# EAGLE design smog_v1_1_ctrl (EAGLE 7.3.0)

## Sheet 1 of 2
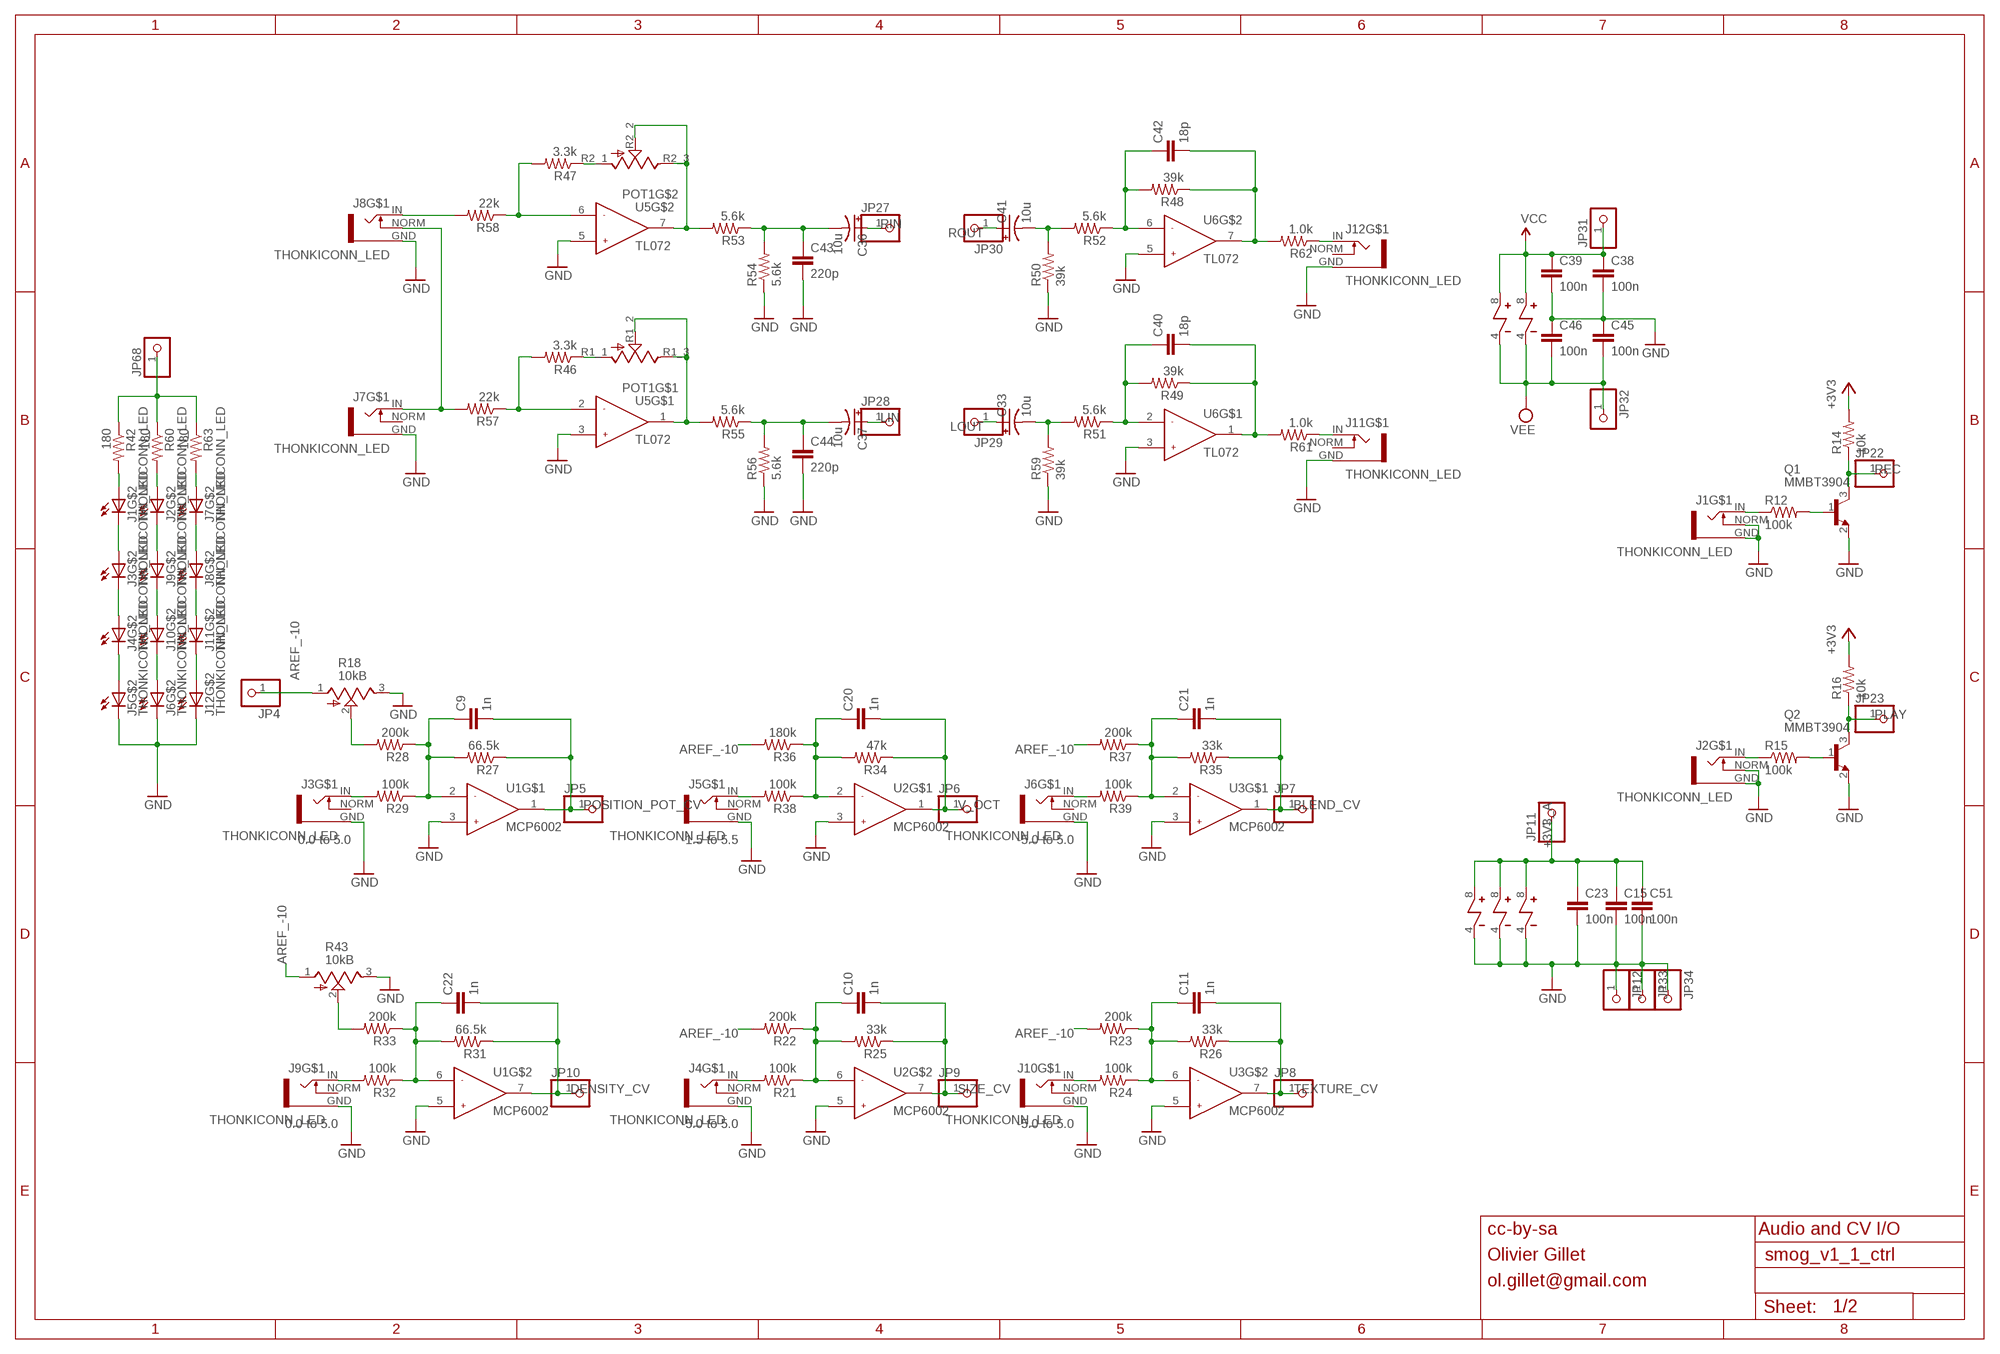
[diagram p0: schematic, sheet 1]

### Parts
C9  1n  CAPACITOR  [RESISTOR_0603]
C10  1n  CAPACITOR  [RESISTOR_0603]
C11  1n  CAPACITOR  [RESISTOR_0603]
C15  100n  CAPACITOR  [RESISTOR_0603]
C20  1n  CAPACITOR  [RESISTOR_0603]
C21  1n  CAPACITOR  [RESISTOR_0603]
C22  1n  CAPACITOR  [RESISTOR_0603]
C23  100n  CAPACITOR  [RESISTOR_0603]
C33  10u  CAP_POL  [PANASONIC_B]
C36  10u  CAP_POL  [PANASONIC_B]
C37  10u  CAP_POL  [PANASONIC_B]
C38  100n  CAPACITOR  [RESISTOR_0603]
C39  100n  CAPACITOR  [RESISTOR_0603]
C40  18p  CAPACITOR  [RESISTOR_0603]
C41  10u  CAP_POL  [PANASONIC_B]
C42  18p  CAPACITOR  [RESISTOR_0603]
C43  220p  CAPACITOR  [RESISTOR_0603]
C44  220p  CAPACITOR  [RESISTOR_0603]
C45  100n  CAPACITOR  [RESISTOR_0603]
C46  100n  CAPACITOR  [RESISTOR_0603]
C51  100n  CAPACITOR  [RESISTOR_0603]
J1  THONKICONN_LED  [LED_JACK]
J2  THONKICONN_LED  [LED_JACK]
J3  THONKICONN_LED  [LED_JACK]
J4  THONKICONN_LED  [LED_JACK]
J5  THONKICONN_LED  [LED_JACK]
J6  THONKICONN_LED  [LED_JACK]
J7  THONKICONN_LED  [LED_JACK]
J8  THONKICONN_LED  [LED_JACK]
J9  THONKICONN_LED  [LED_JACK]
J10  THONKICONN_LED  [LED_JACK]
J11  THONKICONN_LED  [LED_JACK]
J12  THONKICONN_LED  [LED_JACK]
JP4  PINHD-1X1  [1X01]
JP5  PINHD-1X1  [1X01]
JP6  PINHD-1X1  [1X01]
JP7  PINHD-1X1  [1X01]
JP8  PINHD-1X1  [1X01]
JP9  PINHD-1X1  [1X01]
JP10  PINHD-1X1  [1X01]
JP11  PINHD-1X1  [1X01]
JP12  PINHD-1X1  [1X01]
JP22  PINHD-1X1  [1X01]
JP23  PINHD-1X1  [1X01]
JP27  PINHD-1X1  [1X01]
JP28  PINHD-1X1  [1X01]
JP29  PINHD-1X1  [1X01]
JP30  PINHD-1X1  [1X01]
JP31  PINHD-1X1  [1X01]
JP32  PINHD-1X1  [1X01]
JP33  PINHD-1X1  [1X01]
JP34  PINHD-1X1  [1X01]
JP68  PINHD-1X1  [1X01]
POT1  POT_DUAL_THONK  [POT_DUAL_THONK]
Q1  MMBT3904  MMBT3904SOT23  [SOT23]
Q2  MMBT3904  MMBT3904SOT23  [SOT23]
R12  100k  RESISTOR  [RESISTOR_0603]
R14  10k  RESISTOR  [RESISTOR_0603]
R15  100k  RESISTOR  [RESISTOR_0603]
R16  10k  RESISTOR  [RESISTOR_0603]
R18  10kB  POT_VERTICAL  [ALPS_POT_VERTICAL]
R21  100k  RESISTOR  [RESISTOR_0603]
R22  200k  RESISTOR  [RESISTOR_0603]
R23  200k  RESISTOR  [RESISTOR_0603]
R24  100k  RESISTOR  [RESISTOR_0603]
R25  33k  RESISTOR  [RESISTOR_0603]
R26  33k  RESISTOR  [RESISTOR_0603]
R27  66.5k  RESISTOR  [RESISTOR_0603]
R28  200k  RESISTOR  [RESISTOR_0603]
R29  100k  RESISTOR  [RESISTOR_0603]
R31  66.5k  RESISTOR  [RESISTOR_0603]
R32  100k  RESISTOR  [RESISTOR_0603]
R33  200k  RESISTOR  [RESISTOR_0603]
R34  47k  RESISTOR  [RESISTOR_0603]
R35  33k  RESISTOR  [RESISTOR_0603]
R36  180k  RESISTOR  [RESISTOR_0603]
R37  200k  RESISTOR  [RESISTOR_0603]
R38  100k  RESISTOR  [RESISTOR_0603]
R39  100k  RESISTOR  [RESISTOR_0603]
R42  180  RESISTOR  [RESISTOR_0603]
R43  10kB  POT_VERTICAL  [ALPS_POT_VERTICAL]
R46  3.3k  RESISTOR  [RESISTOR_0603]
R47  3.3k  RESISTOR  [RESISTOR_0603]
R48  39k  RESISTOR  [RESISTOR_0603]
R49  39k  RESISTOR  [RESISTOR_0603]
R50  39k  RESISTOR  [RESISTOR_0603]
R51  5.6k  RESISTOR  [RESISTOR_0603]
R52  5.6k  RESISTOR  [RESISTOR_0603]
R53  5.6k  RESISTOR  [RESISTOR_0603]
R54  5.6k  RESISTOR  [RESISTOR_0603]
R55  5.6k  RESISTOR  [RESISTOR_0603]
R56  5.6k  RESISTOR  [RESISTOR_0603]
R57  22k  RESISTOR  [RESISTOR_0603]
R58  22k  RESISTOR  [RESISTOR_0603]
R59  39k  RESISTOR  [RESISTOR_0603]
R60  180  RESISTOR  [RESISTOR_0603]
R61  1.0k  RESISTOR  [RESISTOR_0603]
R62  1.0k  RESISTOR  [RESISTOR_0603]
R63  180  RESISTOR  [RESISTOR_0603]
U1  MCP6002  OPAMP_DUAL  [SOIC8]
U2  MCP6002  OPAMP_DUAL  [SOIC8]
U3  MCP6002  OPAMP_DUAL  [SOIC8]
U5  TL072  OPAMP_DUAL  [SOIC8]
U6  TL072  OPAMP_DUAL  [SOIC8]

### Nets
+3V3 [midwide]: R14.2 R16.2 ; also sheet 2
+3V3_A [midwide]: C15.1 C23.1 C51.1 JP11.1 U1.8 U2.8 U3.8 ; also sheet 2
AREF_-10: JP4.1 R18.1(A) R22.2 R23.2 R36.2 R37.2 R43.1(A)
BLEND_CV: C21.2 JP7.1 R35.1 U3.1
DENSITY_CV: C22.2 JP10.1 R31.1 U1.7
GND: C15.2 C23.2 C38.2 C39.2 C43.2 C44.2 C45.1 C46.1 C51.2 J1.GND J1.NORM J2.GND J2.NORM J3.GND J4.GND J5.C J5.GND J6.C J6.GND J7.GND J8.GND J9.GND J10.GND J11.GND J12.C J12.GND JP12.1 JP33.1 JP34.1 Q1.2(E) Q2.2(E) R18.3(B) R43.3(B) R50.1 R54.1 R56.1 R59.1 U1.3 U1.4 U1.5 U2.3 U2.4 U2.5 U3.3 U3.4 U3.5 U5.3 U5.5 U6.3 U6.5 ; also sheet 2
LIN: C37.+ JP28.1
LOUT: C33.+ JP29.1
LOUT_JACK: J11.IN R61.1
N$1: J4.IN R21.2
N$2: C10.1 R21.1 R22.1 R25.2 U2.6
N$3: J1.C J3.A
N$4: J10.IN R24.2
N$5: C11.1 R23.1 R24.1 R26.2 U3.6
N$6: J6.IN R39.2
N$7: J3.C J4.A
N$8: J4.C J5.A
N$10: J5.IN R38.2
N$11: C20.1 R34.2 R36.1 R38.1 U2.2
N$13: J2.A R60.2
N$14: J9.IN R32.2
N$15: C21.1 R35.2 R37.1 R39.1 U3.2
N$17: J2.C J9.A
N$18: C37.- C44.1 R55.1 R56.2
N$19: J9.C J10.A
N$20: J8.IN R58.2
N$21: J7.IN J8.NORM R57.2
N$22: C36.- C43.1 R53.1 R54.2
N$23: C41.- R50.2 R52.2
N$24: C22.1 R31.2 R32.1 R33.1 U1.6
N$25: C42.1 R48.2 R52.1 U6.6
N$26: R33.2 R43.2(W)
N$27: J3.IN R29.2
N$28: C42.2 R48.1 R62.2 U6.7
N$30: C9.1 R27.2 R28.1 R29.1 U1.2
N$31: C33.- R51.2 R59.2
N$32: C40.1 R49.2 R51.1 U6.2
N$33: C40.2 R49.1 R61.2 U6.1
N$35: R18.2(W) R28.2
N$36: J2.IN R15.1
N$37: Q2.1(B) R15.2
N$42: POT1.R2_2(W) POT1.R2_3(B) R53.2 U5.7
N$51: POT1.R1_2(W) POT1.R1_3(B) R55.2 U5.1
N$52: POT1.R2_1(A) R47.1
N$53: POT1.R1_1(A) R46.1
N$54: R47.2 R58.1 U5.6
N$55: J6.A J10.C
N$56: J7.A R63.2
N$57: J1.IN R12.1
N$58: R46.2 R57.1 U5.2
N$59: J7.C J8.A
N$60: J8.C J11.A
N$61: J11.C J12.A
N$62: J1.A R42.2
N$66: Q1.1(B) R12.2
N$75 [wide]: JP68.1 R42.1 R60.1 R63.1
PLAY: JP23.1 Q2.3(C) R16.1
POSITION_POT_CV: C9.2 JP5.1 R27.1 U1.1
REC: JP22.1 Q1.3(C) R14.1
RIN: C36.+ JP27.1
ROUT: C41.+ JP30.1
ROUT_JACK: J12.IN R62.1
SIZE_CV: C10.2 JP9.1 R25.1 U2.7
TEXTURE_CV: C11.2 JP8.1 R26.1 U3.7
V_OCT: C20.2 JP6.1 R34.1 U2.1
VCC [wide]: C38.1 C39.1 JP31.1 U5.8 U6.8
VEE [wide]: C45.2 C46.2 JP32.1 U5.4 U6.4
Unconnected: J3.NORM J4.NORM J5.NORM J6.NORM J7.NORM J9.NORM J10.NORM J11.NORM J12.NORM

### Notes on the sheet
- 0.0 to 5.0 | -1.5 to 5.5 | -5.0 to 5.0
- 0.0 to 5.0 | -5.0 to 5.0 | -5.0 to 5.0
- cc-by-sa | Audio and CV I/O
- Olivier Gillet
- ol.gillet@gmail.com

## Sheet 2 of 2
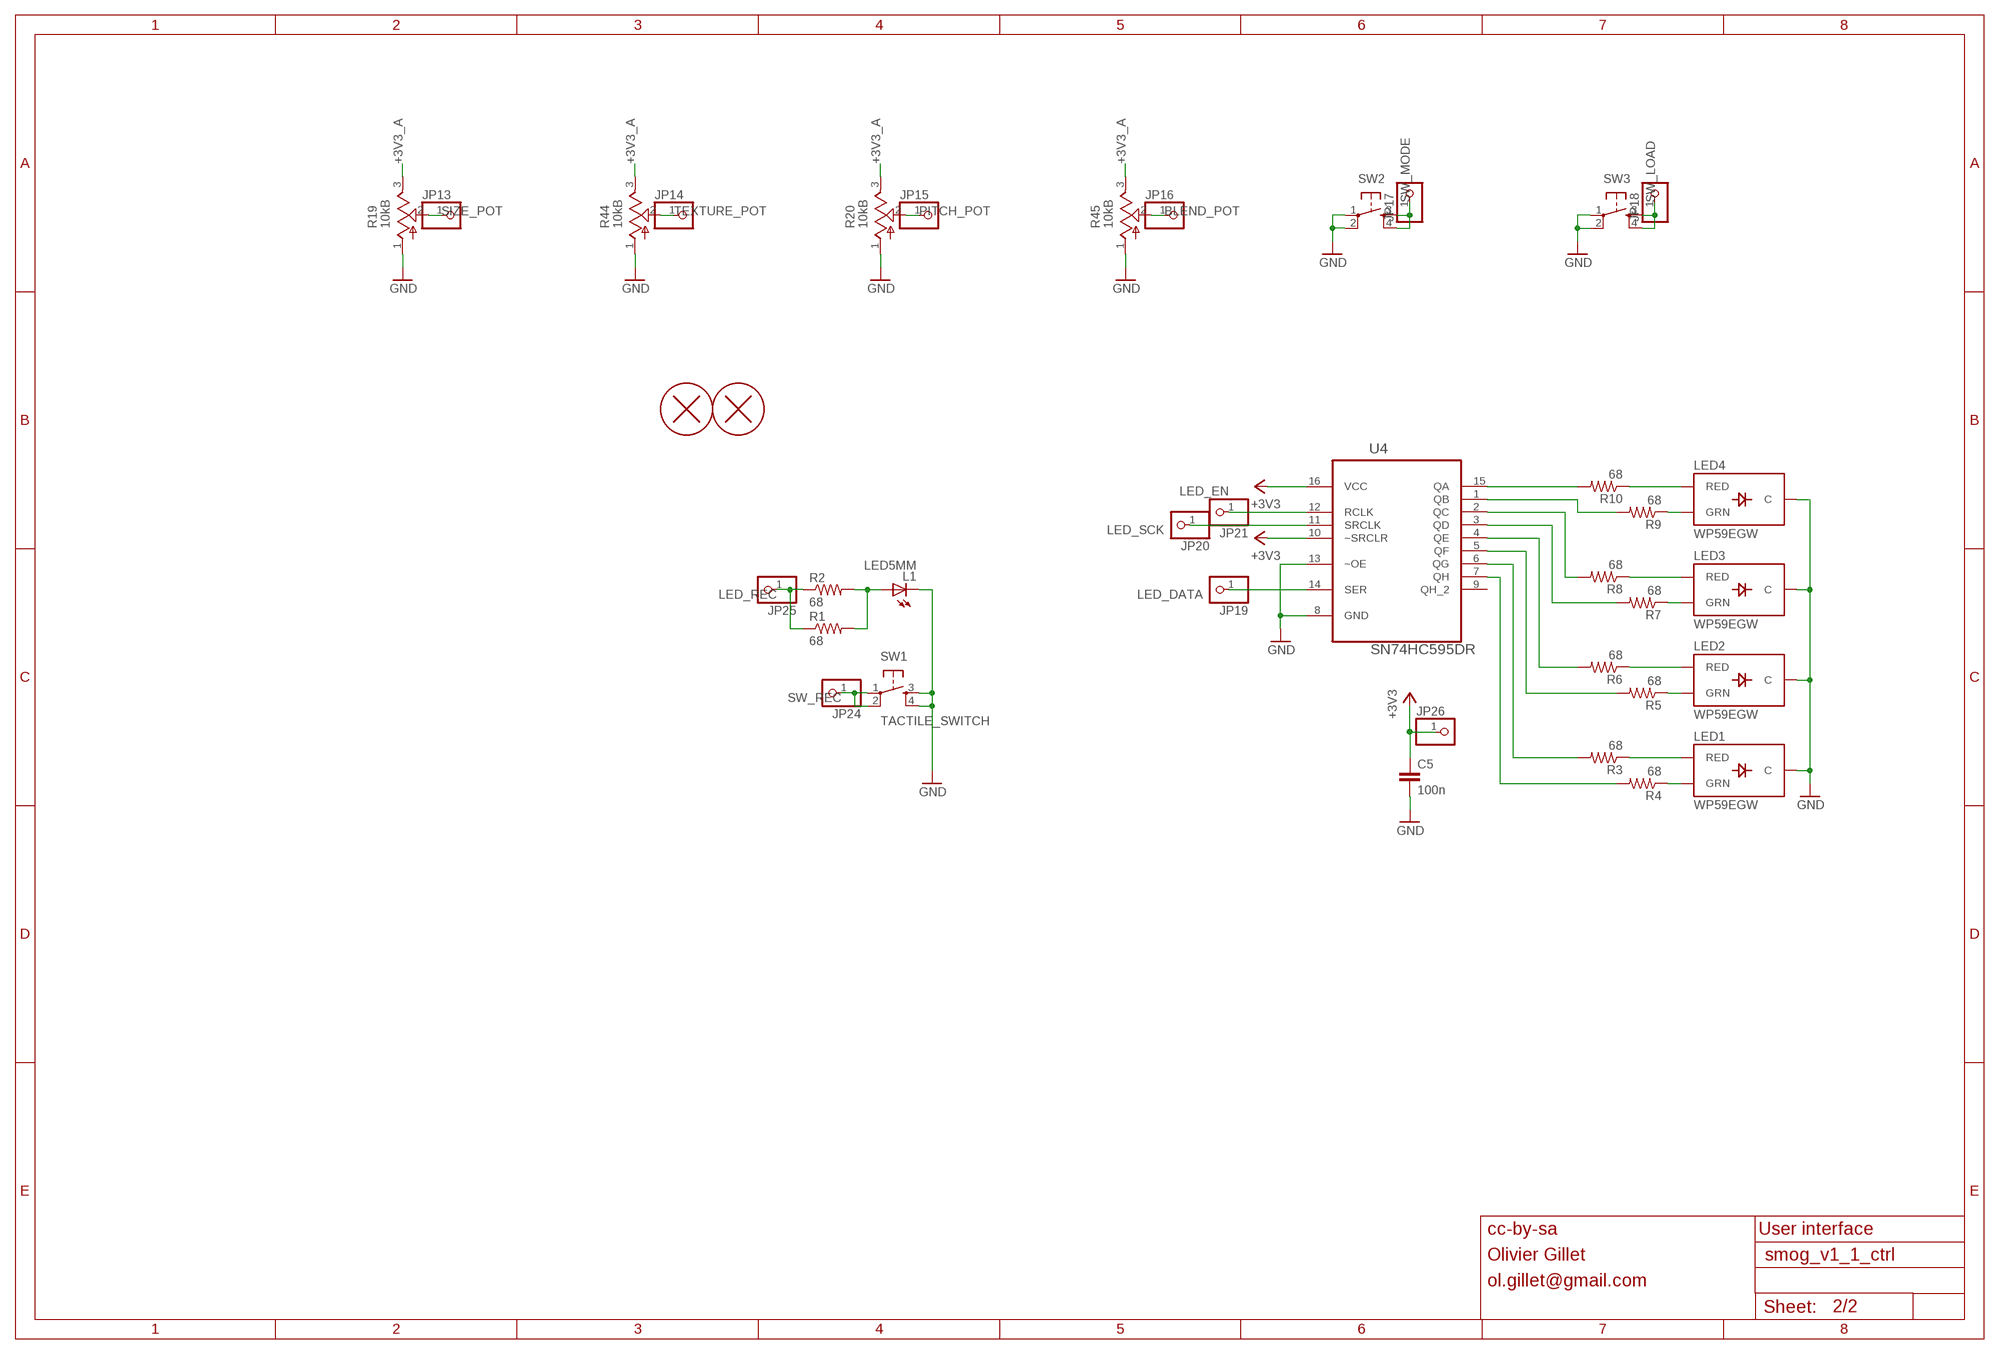
[diagram p1: schematic, sheet 2]

### Parts
C5  100n  CAPACITOR  [RESISTOR_0603]
H1  PCB_SCREW  [PCB_SCREW]
H2  PCB_SCREW  [PCB_SCREW]
JP13  PINHD-1X1  [1X01]
JP14  PINHD-1X1  [1X01]
JP15  PINHD-1X1  [1X01]
JP16  PINHD-1X1  [1X01]
JP17  PINHD-1X1  [1X01]
JP18  PINHD-1X1  [1X01]
JP19  PINHD-1X1  [1X01]
JP20  PINHD-1X1  [1X01]
JP21  PINHD-1X1  [1X01]
JP24  PINHD-1X1  [1X01]
JP25  PINHD-1X1  [1X01]
JP26  PINHD-1X1  [1X01]
L1  LED5MM  [LED_5MM]
LED1  WP59EGW  LED_BICOLOR_THROUGHHOLE  [LED_BICOLOR]
LED2  WP59EGW  LED_BICOLOR_THROUGHHOLE  [LED_BICOLOR]
LED3  WP59EGW  LED_BICOLOR_THROUGHHOLE  [LED_BICOLOR]
LED4  WP59EGW  LED_BICOLOR_THROUGHHOLE  [LED_BICOLOR]
R1  68  RESISTOR  [RESISTOR_0603]
R2  68  RESISTOR  [RESISTOR_0603]
R3  68  RESISTOR  [RESISTOR_0603]
R4  68  RESISTOR  [RESISTOR_0603]
R5  68  RESISTOR  [RESISTOR_0603]
R6  68  RESISTOR  [RESISTOR_0603]
R7  68  RESISTOR  [RESISTOR_0603]
R8  68  RESISTOR  [RESISTOR_0603]
R9  68  RESISTOR  [RESISTOR_0603]
R10  68  RESISTOR  [RESISTOR_0603]
R19  10kB  POT_VERTICAL  [ALPS_POT_VERTICAL]
R20  10kB  POT_VERTICAL  [ALPS_POT_VERTICAL]
R44  10kB  POT_VERTICAL  [ALPS_POT_VERTICAL]
R45  10kB  POT_VERTICAL  [ALPS_POT_VERTICAL]
SW1  TACTILE_SWITCH  [TACTILE-PTH]
SW2  TACTILE_SWITCH  [TACTILE-PTH]
SW3  TACTILE_SWITCH  [TACTILE-PTH]
U4  SN74HC595DR  [SOIC16]

### Nets
+3V3 [midwide]: C5.1 JP26.1 U4.10(~SRCLR) U4.16(VCC) ; also sheet 1
+3V3_A [midwide]: R19.3(B) R20.3(B) R44.3(B) R45.3(B) ; also sheet 1
BLEND_POT: JP16.1 R45.2(W)
GND: C5.2 L1.K(C) LED1.2(C) LED2.2(C) LED3.2(C) LED4.2(C) R19.1(A) R20.1(A) R44.1(A) R45.1(A) SW1.3 SW1.4 SW2.1 SW2.2 SW3.1 SW3.2 U4.8(GND) U4.13(~OE) ; also sheet 1
LED_DATA: JP19.1 U4.14(SER)
LED_EN: JP21.1 U4.12(RCLK)
LED_REC: JP25.1 R1.1 R2.1
LED_SCK: JP20.1 U4.11(SRCLK)
N$9: LED4.1(GRN) R9.1
N$12: LED4.3(RED) R10.1
N$16: LED3.3(RED) R8.1
N$29: LED3.1(GRN) R7.1
N$34: LED2.3(RED) R6.1
N$38: L1.A R1.2 R2.2
N$39: LED2.1(GRN) R5.1
N$40: LED1.3(RED) R3.1
N$41: LED1.1(GRN) R4.1
N$43: R10.2 U4.15(QA)
N$44: R9.2 U4.1(QB)
N$45: R8.2 U4.2(QC)
N$46: R7.2 U4.3(QD)
N$47: R6.2 U4.4(QE)
N$48: R5.2 U4.5(QF)
N$49: R3.2 U4.6(QG)
N$50: R4.2 U4.7(QH)
PITCH_POT: JP15.1 R20.2(W)
SIZE_POT: JP13.1 R19.2(W)
SW_LOAD: JP18.1 SW3.3 SW3.4
SW_MODE: JP17.1 SW2.3 SW2.4
SW_REC: JP24.1 SW1.1 SW1.2
TEXTURE_POT: JP14.1 R44.2(W)
Unconnected: U4.9(QH_2)

### Notes on the sheet
- cc-by-sa | User interface
- Olivier Gillet
- ol.gillet@gmail.com

## Library data of the parts
C5 C9-C11 C15 C20-C23 C38-C40 C42-C46 C51 = parts_aman:CAPACITOR
C33 C36 C37 C41 = parts_aman:CAP_POL
H1 H2 = parts_aman:PCB_SCREW
J1-J12 = parts_aman:THONKICONN_LED
JP4-JP34 JP68 = parts_aman:PINHD-1X1: PIN HEADER
L1 = parts_aman:LED
LED1-LED4 = parts_aman:LED_BICOLOR_THROUGHHOLE
POT1 = parts_aman:POT_DUAL_THONK
Q1 Q2 = parts_aman:MMBT3904
R1-R10 R12 R14-R16 R21-R29 R31-R39 R42 R46-R63 = parts_aman:RESISTOR
R18-R20 R43-R45 = parts_aman:POT_VERTICAL
SW1-SW3 = parts_aman:TACTILE_SWITCH
U1-U3 U5 U6 = parts_aman:OPAMP_DUAL
U4 = parts_aman:SN74HC595DR: 8-BIT SHIFT REGISTERS WITH 3-STATE OUTPUT REGISTERS; MPN: SN74HC595DR; OC_FARNELL: 1607849; OC_NEWARK: 67K2850; PACKAGE: SOIC-16; SUPPLIER: TEXAS INSTRUMENTS

## Net classes
0 default: width 0.152 mm, drill 0.305 mm, clearance 0.152 mm
1 midwide: width 0.229 mm, drill 0.305 mm, clearance 0.152 mm
2 wide: width 0.305 mm, drill 0.305 mm, clearance 0.152 mm

## Board
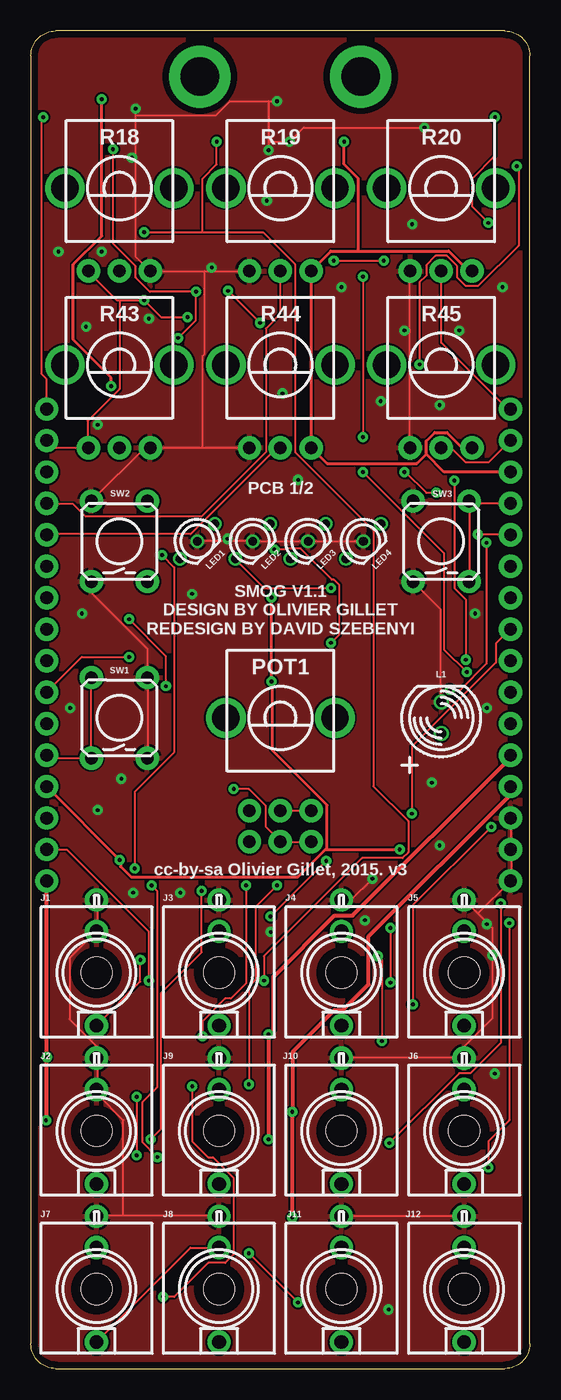
[diagram p2: board, top side]
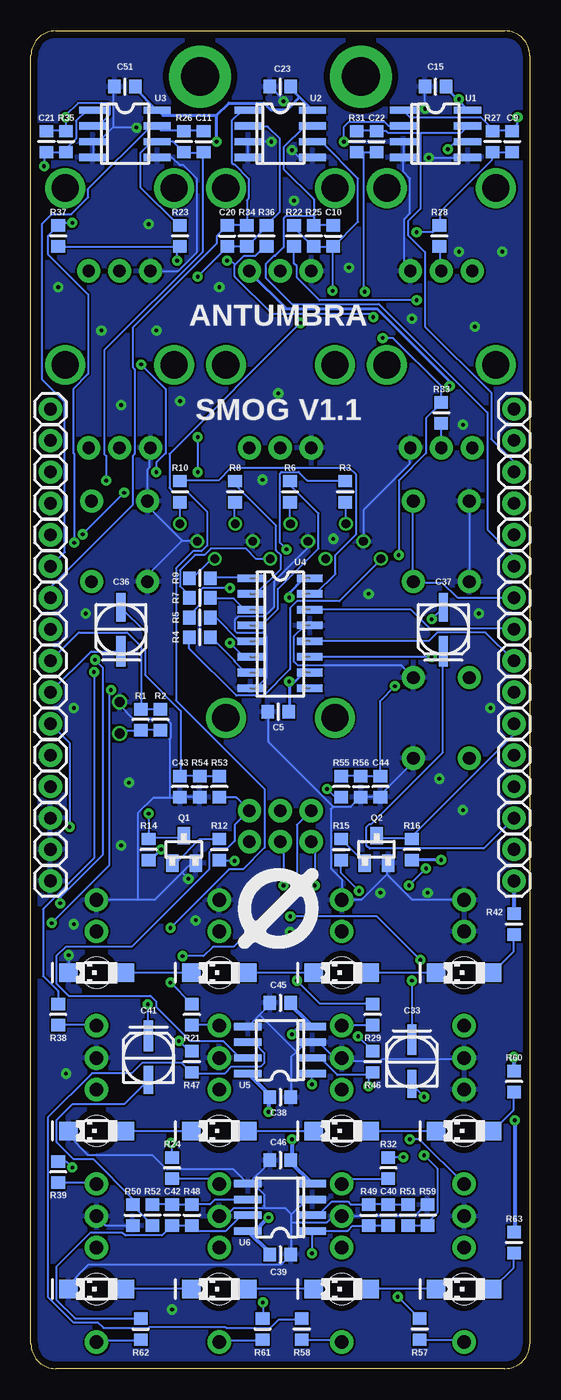
[diagram p3: board, bottom side, seen from below]

Size 40.3 x 108 mm. Coordinates in mm from the lower left corner, seen from the top.
Outline: 2,0 38.3,0 arc90 40.3,2 40.3,106 arc90 38.3,108 2,108 arc90 0,106 0,2 arc90 2,0
Copper layers (1*16): Top 0.035mm / dielectric 1.5mm / Bottom 0.035mm
Design rules "PCBCart-Standard": minimum track width 6mil, minimum drill 12mil, track to track 6mil, track to pad 6mil, pad to pad 6mil, via to via 6mil, smd to smd 6mil, copper to edge 20mil, drill to drill 8mil, minimum pad ring 8mil, minimum via ring 10mil, stop-mask expansion 3mil, vias tented up to drill 25mil, thermal gap 8mil

### Footprints (pad centres in the part's own frame; a part is rotated, then mirrored left to right if it is on the bottom)
RESISTOR_0603 = smd 1 x 1.1: 1 -0.85,0; 2 0.85,0
PANASONIC_B = smd 2.464 x 0.762: + 1.778,0 | smd 2.286 x 0.762: - -1.778,0
PCB_SCREW = drill 3.1 pad 5: P$1 0,0
LED_JACK = smd 1.5 x 1.5 bottom: A 2.266,0; C -2.266,0 | drill 1.1 pad 1.88: GND 0,-5.88; IN 0,4.28; NORM 0,-3.34 | hole 2.5: 0,0
1X01 = drill 1.016 pad 1.88: 1 0,0
LED_5MM = drill 0.813: A -1.27,0; K 1.27,0
LED_BICOLOR = drill 0.7: 1 -2,0; 2 0,0; 3 2,0
POT_DUAL_THONK = drill 2.2 pad 3.175: P$4 4.4,0; P$5 -4.4,0 | drill 1 pad 1.88: R1_1 -2.5,-10; R1_2 0,-10; R1_3 2.5,-10; R2_1 -2.5,-7.5; R2_2 0,-7.5; R2_3 2.5,-7.5
SOT23 = smd 1 x 1.4: 1 -0.95,-1.1; 2 0.95,-1.1; 3 0,1.1
ALPS_POT_VERTICAL = drill 1 pad 1.88: 1 -2.5,-6.7; 2 0,-6.7; 3 2.5,-6.7 | drill 2.2 pad 3.175: P$4 4.4,0; P$5 -4.4,0
TACTILE-PTH = drill 1.016 pad 1.88: 1 -3.251,2.261; 2 3.251,2.261; 3 -3.251,-2.261; 4 3.251,-2.261
SOIC8 = smd 0.6 x 2.2: 1 -1.905,-2.6; 2 -0.635,-2.6; 3 0.635,-2.6; 4 1.905,-2.6; 5 1.905,2.6; 6 0.635,2.6; 7 -0.635,2.6; 8 -1.905,2.6
SOIC16 = smd 2.057 x 0.61: 1 -2.419,4.445; 2 -2.419,3.175; 3 -2.419,1.905; 4 -2.419,0.635; 5 -2.419,-0.635; 6 -2.419,-1.905; 7 -2.419,-3.175; 8 -2.419,-4.445; 9 2.381,-4.445; 10 2.381,-3.175; 11 2.381,-1.905; 12 2.381,-0.635; 13 2.381,0.635; 14 2.381,1.905; 15 2.381,3.175; 16 2.381,4.445

### Placement (x,y rotation side)
C5  20.32,53.02 180 bottom
C9  1.42,99.06 90 bottom
C10  15.88,91.44 90 bottom
C11  26.35,99.06 90 bottom
C15  7.62,103.5 180 bottom
C20  24.45,91.44 90 bottom
C21  39.05,99.06 270 bottom
C22  12.38,99.06 90 bottom
C23  20.15,103.5 180 bottom
C33  9.53,24.77 90 bottom
C36  33.02,59.69 270 bottom
C37  6.99,59.69 270 bottom
C38  20.16,21.91 0 bottom
C39  20.16,9.21 0 bottom
C40  11.43,12.38 270 bottom
C41  30.8,25.08 90 bottom
C42  28.89,12.38 270 bottom
C43  28.26,46.99 270 bottom
C44  12.06,46.99 270 bottom
C45  20.16,29.53 0 bottom
C46  20.16,16.83 0 bottom
C51  32.7,103.5 180 bottom
H1  26.64,104.31 0 top
H2  13.64,104.31 0 top
J1  5.3,31.96 180 top
J2  5.3,19.19 180 top
J3  15.19,31.96 180 top
J4  25.08,31.96 180 top
J5  35,31.96 180 top
J6  35,19.19 180 top
J7  5.3,6.42 180 top
J8  15.19,6.42 180 top
J9  15.19,19.19 180 top
J10  25.08,19.19 180 top
J11  25.08,6.42 180 top
J12  35,6.42 180 top
JP4  1.27,74.93 0 bottom
JP5  1.27,77.47 0 bottom
JP6  38.73,62.23 0 bottom
JP7  38.73,67.31 0 bottom
JP8  38.73,64.77 0 bottom
JP9  1.27,64.77 0 bottom
JP10  1.27,72.39 0 bottom
JP11  38.73,72.39 0 bottom
JP12  38.73,39.37 0 bottom
JP13  1.27,69.85 0 bottom
JP14  1.27,67.31 0 bottom
JP15  38.73,77.47 0 bottom
JP16  38.73,74.93 0 bottom
JP17  1.27,62.23 0 bottom
JP18  38.73,69.85 0 bottom
JP19  1.27,59.69 0 bottom
JP20  1.27,54.61 0 bottom
JP21  1.27,57.15 0 bottom
JP22  38.73,59.69 0 bottom
JP23  1.27,52.07 0 bottom
JP24  1.27,49.53 0 bottom
JP25  38.73,57.15 0 bottom
JP26  1.27,46.99 0 bottom
JP27  38.73,54.61 0 bottom
JP28  1.27,44.45 0 bottom
JP29  1.27,41.91 0 bottom
JP30  38.73,52.07 0 bottom
JP31  38.73,46.99 0 bottom
JP32  38.73,49.53 0 bottom
JP33  38.73,44.45 0 bottom
JP34  38.73,41.91 0 bottom
JP68  1.27,39.37 0 bottom
L1  33.14,52.54 90 top
LED1  13.44,66.79 45 top
LED2  17.91,66.79 45 top
LED3  22.39,66.79 45 top
LED4  26.86,66.79 45 top
POT1  20.15,52.54 0 top
Q1  27.94,41.91 0 bottom
Q2  12.38,41.91 0 bottom
R1  31.43,52.39 270 bottom
R2  29.84,52.39 270 bottom
R3  14.92,70.8 90 bottom
R4  26.67,59.05 0 bottom
R5  26.67,60.64 0 bottom
R6  19.37,70.8 90 bottom
R7  26.67,62.23 0 bottom
R8  23.81,70.8 90 bottom
R9  26.67,63.82 0 bottom
R10  28.26,70.8 90 bottom
R12  25.08,41.91 90 bottom
R14  30.8,41.91 270 bottom
R15  15.24,41.91 90 bottom
R16  9.53,41.91 270 bottom
R18  7.14,95.32 0 top
R19  20.15,95.32 0 top
R20  33.14,95.32 0 top
R21  27.3,28.57 270 bottom
R22  19.05,91.44 270 bottom
R23  28.26,91.44 270 bottom
R24  28.89,16.19 270 bottom
R25  17.46,91.44 270 bottom
R26  27.94,99.06 270 bottom
R27  3.01,99.06 270 bottom
R28  7.3,91.44 270 bottom
R29  12.7,28.57 270 bottom
R31  13.97,99.06 270 bottom
R32  11.43,16.19 270 bottom
R33  7.15,77.15 270 bottom
R34  22.86,91.44 270 bottom
R35  37.47,99.06 90 bottom
R36  21.27,91.44 270 bottom
R37  38.1,91.44 270 bottom
R38  38.1,28.57 270 bottom
R39  38.1,15.88 270 bottom
R42  1.27,35.88 270 bottom
R43  7.14,81.04 0 top
R44  20.15,81.04 0 top
R45  33.14,81.04 0 top
R46  12.7,24.77 270 bottom
R47  27.3,24.77 270 bottom
R48  27.3,12.38 90 bottom
R49  13.02,12.38 90 bottom
R50  32.07,12.38 90 bottom
R51  9.84,12.38 270 bottom
R52  30.48,12.38 270 bottom
R53  25.08,46.99 270 bottom
R54  26.67,46.99 90 bottom
R55  15.24,46.99 270 bottom
R56  13.65,46.99 90 bottom
R57  8.89,3.17 270 bottom
R58  18.41,3.17 270 bottom
R59  8.26,12.38 270 bottom
R60  1.27,23.18 270 bottom
R61  21.59,3.17 90 bottom
R62  31.43,3.17 90 bottom
R63  1.27,10.16 270 bottom
SW1  7.14,52.54 90 top
SW2  7.14,66.79 90 top
SW3  33.14,66.79 90 top
U1  7.62,99.69 270 bottom
U2  20.15,99.69 270 bottom
U3  32.7,99.69 270 bottom
U4  20.15,59.37 0 bottom
U5  20.17,25.72 90 bottom
U6  20.17,13.02 90 bottom
U$1  [LOGO_6.5]  20.32,37.15 0 bottom

### Tracks (layer width: path | path; a pad name or v marks a point on that pad's centre or on a via)
+3V3  (via drill 0.3)
  Top 0.229: v19.43,62.26 v19.43,55.47 19.51,55.4 19.51,49.91 23.93,45.49 23.93,41.91 | JP26.1 1.29,46.94 v7.16,41.07 7.24,41 7.24,40.54 8.08,39.7 21.57,39.7 23.77,41.91 23.93,41.91 | 23.93,41.91 v29.79,41.91
  Bottom 0.229: 19.2,55.24 18.29,56.16 17.83,56.16 U4.10 | 19.2,55.24 19.43,55.02 19.43,53.03 C5.1 | v19.43,62.26 19.43,62.64 18.29,63.78 17.83,63.78 U4.16 | 19.2,55.24 v19.43,55.47 | v7.16,41.07 9.53,41.07 R16.2 | v29.79,41.91 30.63,41.07 30.79,41.07 R14.2
+3V3_A  (via drill 0.3)
  Top 0.229: 31.93,73.84 31.93,74.91 32.61,75.59 33.6,75.59 34.82,74.37 35.59,74.37 R45.3 | 31.93,73.84 33.38,72.39 JP11.1 | v5.71,102.49 5.71,91.44 3.43,89.15 3.43,83.06 6.48,80.01 v6.48,79.32 | 26.44,90.22 24.23,90.22 22.71,88.7 R19.3 22.63,88.54 22.63,74.37 R44.3 22.71,74.3 23.93,73.08 31.17,73.08 31.93,73.84 | 26.44,90.22 33.76,90.22 35.36,88.62 35.59,88.62 R20.3 | v25.3,99.06 25.3,97.23 26.44,96.09 26.44,90.22
  Bottom 0.229: 18.59,102.64 17.6,101.65 U2.8 | 18.59,102.64 19.28,103.33 19.28,103.48 C23.1 | C51.1 31.85,103.48 31.85,103.33 30.18,101.65 U3.8 30.02,101.58 29.64,101.19 25.3,101.19 | 18.59,102.64 19.58,101.65 20.95,101.65 21.49,102.18 24.31,102.18 25.3,101.19 | 5.79,102.41 5.03,101.65 U1.8 | 5.79,102.41 6.71,103.33 6.71,103.48 C15.1 | v6.48,79.32 6.48,79.7 12.34,85.57 19.66,85.57 22.63,88.54 R19.3 | v5.71,102.49 5.79,102.41 | v25.3,99.06 25.3,101.19
AREF_-10  (via drill 0.3)
  Top 0.152: JP4.1 1.83,74.37 4.57,74.37 R43.1 4.57,74.45 4.57,76.5 7.16,79.1 7.16,86.26 | 7.16,86.26 6.93,86.26 4.65,88.54 R18.1 | 7.16,86.26 v9.14,86.26 10.52,84.89 v12.65,84.89 | v24.46,89.46 v28.5,89.46
  Bottom 0.152: 28.5,90.6 38.1,90.6 R37.2 | 28.5,90.6 28.27,90.6 R23.2 28.5,90.6 | R22.2 19.05,89.23 18.82,89 18.82,88.09 16.99,86.26 v9.14,86.26 | 23.81,89.12 23.85,89.08 23.85,88.16 20.8,85.11 12.88,85.11 v12.65,84.89 | 23.81,89.12 23.09,89.84 22.17,89.84 21.49,90.53 21.34,90.53 R36.2 | v28.5,89.46 28.5,90.6 | v24.46,89.46 24.16,89.46 23.81,89.12
BLEND_CV  (via drill 0.3)
  Top 0.152: v36.12,67.36 38.71,67.36 JP7.1 | v32.77,70.71 31.93,70.71 30.25,72.39 v30.18,72.39 | v31.39,81.08 31.39,87.71 31.93,88.24 31.93,89.08 32.69,89.84 33.6,89.84 34.44,89 34.44,88.09 35.13,87.4 36.12,87.4 39.4,90.68 39.4,96.93 v39.24,97.08
  Bottom 0.152: U3.1 35.36,101.58 35.81,101.58 36.65,100.74 36.65,99.29 37.49,98.45 37.49,98.3 R35.1 37.49,98.22 39.01,98.22 C21.2 39.09,98.15 39.24,97.99 v39.24,97.08 | v32.77,70.71 v36.12,67.36 | v30.18,72.39 30.18,73.15 29.41,73.91 29.41,79.1 v31.39,81.08
BLEND_POT
  Top 0.152: JP16.1 36.96,73.15 35.13,73.15 33.98,74.3 33.15,74.3 R45.2
DENSITY_CV
  Bottom 0.152: R31.1 13.95,99.97 12.42,99.97 C22.2 12.34,99.9 11.58,99.9 11.43,99.75 8.84,99.75 | 8.84,99.75 5.56,99.75 5.03,100.28 U1.7 | 8.84,99.75 8.84,93.65 9.83,92.66 9.83,91.52 8.46,90.14 8.46,84.12 3.12,78.79 3.12,75.06 1.29,73.23 1.29,72.39 JP10.1
GND  (via drill 0.3)
  Top 0.152: 7.47,12.34 15.16,12.34 J8.GND | 7.47,12.34 5.33,12.34 J7.GND | J12.GND 34.98,12.34 25.15,12.34 J11.GND | 7.47,12.34 7.47,20.04 5.33,22.17 5.33,22.48 J2.NORM 5.33,22.55 5.33,24.99 J2.GND 5.26,25.07 5.26,26.06 3.12,28.19 3.12,33.15 5.26,35.28 J1.NORM 5.33,35.36 5.33,37.8 J1.GND | 8.46,97.77 8.46,89.76 9.6,88.62 R18.3 9.68,88.62 14.02,88.62 | 8.46,97.77 8.46,101.19 | 8.46,101.19 v8.46,101.73 | 19.2,102.34 16.08,102.34 14.94,101.19 8.46,101.19 | 19.2,102.34 v19.89,102.34 | 8.46,97.77 v8.15,97.77 | 19.2,102.34 19.2,99.06 | 19.2,99.06 v19.2,98.37 | 19.2,99.06 v20.88,99.06 22.02,100.2 v31.77,100.2 | 14.02,88.62 17.6,88.62 R19.1 | SW1.3 9.45,49.3 9.45,55.78 SW1.4 9.37,55.85 9.37,58.14 4.95,62.56 4.95,63.48 SW2.1 | J10.GND 25.15,25.07 34.98,25.07 J6.GND 34.98,25.15 34.98,25.98 37.26,28.27 v37.26,33.38 37.26,35.59 36.12,36.73 | 38.79,41.91 38.79,39.4 JP12.1 38.71,39.32 36.12,36.73 | 38.79,41.91 38.79,44.42 JP33.1 | 38.79,41.91 JP34.1 | 36.12,36.73 35.05,37.8 J5.GND | v27.58,39.55 25.91,37.87 25.15,37.87 J4.GND | SW2.2 4.95,70.1 9.14,74.3 9.6,74.3 R43.3 9.68,74.37 13.87,74.37 | 13.87,74.37 17.6,74.37 R44.1 | L1.K 33.07,53.87 33.07,61.34 30.94,63.48 SW3.1 | LED1.2 13.49,66.83 17.91,66.83 LED2.2 17.98,66.83 22.33,66.83 LED3.2 22.4,66.83 26.82,66.83 LED4.2 | R20.1 30.63,88.54 30.63,74.37 R45.1 | 14.02,88.62 14.02,81.92 13.87,81.76 13.87,74.37
  Bottom 0.152: 21.83,28.54 22.71,27.66 U5.5 | 21.83,28.54 21.03,29.34 21.03,29.49 C45.1 | 18.86,25.57 18.14,26.29 17.6,26.29 U5.3 17.53,26.29 16.99,26.29 15.77,25.07 15.24,25.07 J9.GND 15.16,24.99 15.01,24.84 12.04,24.84 11.89,24.99 5.33,24.99 J2.GND | 18.86,25.57 19.28,25.15 19.28,21.95 C38.2 | 18.86,25.57 21.83,28.54 | C46.1 21.03,16.76 21.03,16.61 22.71,14.94 U6.5 | J6.C 37.26,19.13 37.26,18.82 35.66,17.22 30.48,17.22 29.34,16.08 23.93,16.08 22.78,14.94 U6.5 | R59.1 8.31,13.18 8.46,13.18 9.3,12.34 15.16,12.34 J8.GND 15.24,12.27 15.93,12.27 16.38,11.81 19.28,11.81 | R50.1 32.08,11.58 34.29,11.58 34.98,12.27 J12.GND | 19.28,11.81 19.28,12.42 19.24,12.46 | 19.28,11.81 19.28,9.22 C39.2 19.36,9.14 20.12,8.38 35.66,8.38 37.26,6.78 37.26,6.48 J12.C | 19.24,12.46 18.06,13.64 17.6,13.64 U6.3 | 21.41,12.95 19.74,12.95 19.24,12.46 | 21.41,12.95 23.93,12.95 24.54,12.34 25.07,12.34 J11.GND | 21.41,12.95 21.41,14.02 22.48,15.09 U6.5 | 33.64,100.24 34.82,99.06 35.28,99.06 | 33.64,100.24 33.6,100.28 33.6,103.48 C51.2 | 35.28,99.06 35.28,97.84 U3.4 | 35.28,99.06 U3.3 | U2.4 22.78,97.84 22.78,99.06 U2.3 v20.88,99.06 | U1.3 10.21,97.84 U1.4 10.21,97.77 10.21,96.62 9.68,96.09 9.68,93.27 10.13,92.81 10.13,89.08 9.68,88.62 R18.3 | v8.46,101.73 8.46,103.48 C15.2 | v19.89,102.34 19.89,102.41 20.95,103.48 C23.2 | v8.15,97.77 5.03,97.77 U1.5 | v19.2,98.37 18.67,97.84 17.6,97.84 U2.5 | v31.77,100.2 33.6,100.2 33.64,100.24 | 11.54,39.89 13.56,37.87 15.16,37.87 J3.GND 15.16,37.95 15.16,39.47 16.08,40.39 16.08,45.19 15.89,45.38 | 11.54,39.89 11.51,39.93 11.51,40.77 Q2.2 | 11.54,39.89 9.53,37.87 5.33,37.87 J1.GND
  Bottom 0.152: U4.13 17.83,59.97 18.21,59.97 19.05,59.13 19.05,57.07 18.75,56.77 10.36,56.77 9.45,55.85 SW1.4 | 15.89,45.38 15.85,45.34 14.48,45.34 13.72,46.1 R56.1 13.64,46.18 12.12,46.18 C44.2 12.12,46.25 9.45,48.92 9.45,49.23 SW1.3 | 15.89,45.38 21.11,50.6 21.11,52.96 C5.2 | R54.1 26.67,46.18 28.19,46.18 C43.2 28.27,46.1 29.11,46.1 | 28.08,40.04 30.25,37.87 31.62,37.87 | 28.08,40.04 27.36,40.77 27.05,40.77 Q1.2 | 31.62,37.87 34.98,37.87 J5.GND | v37.26,33.38 37.26,32 J5.C | 29.11,46.1 30.4,46.1 31.62,44.88 31.62,37.87 | 28.08,40.04 v27.58,39.55 | SW2.1 4.88,63.55 4.88,70.03 SW2.2 | U3.5 30.1,97.77 28.88,97.77 28.27,97.16 27.96,97.16 26.9,96.09 26.9,90.14 28.42,88.62 R20.1 | R45.1 30.71,74.3 30.71,72.77 30.86,72.62 30.86,70.1 SW3.2 30.86,70.03 30.86,69.65 28.08,66.86 | U4.8 22.55,54.94 22.1,54.94 21.26,55.78 21.26,59.13 21.57,59.44 23.7,59.44 23.85,59.59 23.85,60.43 23.55,60.73 21.41,60.73 20.65,61.49 20.65,63.55 17.98,66.22 17.98,66.75 LED2.2 | 28.08,66.86 28.04,66.83 26.9,66.83 LED4.2 | 28.08,66.86 30.86,64.08 30.86,63.55 SW3.1 | R43.3 9.68,74.3 9.68,73.08 13.41,69.34 13.41,66.83 LED1.2 | 29.11,46.1 29.11,50.83 29.03,50.9 29.03,52.12 29.41,52.5 32.08,52.5 33.07,53.49 33.07,53.8 L1.K
  other vias: 28.89,4.76 37.47,23.81 19.37,35.24 8.26,38.42 5.4,45.09 7.3,47.62 32.38,47.31 36.83,53.34 13.02,62.55 4.13,60.96 3.17,53.34 9.53,84.77 2.22,90.17 4.45,84.14 5.71,90.17 14.61,88.9 5.4,76.2 25.08,87.31 30.16,83.82 28.26,78.11 20.32,78.74 21.59,71.75 34.61,83.82 30.8,92.39 38.1,87.31 33.02,77.79 12.06,38.42 36.83,35.88 33.02,42.23 26.99,36.2 35.88,60.96 19.05,94.3 15.88,66.99
  pour Top: 0,0 40.32,0 40.32,107.95 0,107.95
  pour Bottom: 0,0 40.32,0 40.32,107.95 0,107.95
LED_DATA
  Bottom 0.152: U4.14 17.75,61.27 9.6,61.27 8.08,59.74 1.29,59.74 JP19.1
LED_EN
  Bottom 0.152: U4.12 17.75,58.75 8.15,58.75 7.47,59.44 3.58,59.44 1.29,57.15 JP21.1
LED_REC
  Bottom 0.152: R2.1 29.87,53.26 31.39,53.26 R1.1 31.39,53.34 31.39,58.29 32.54,59.44 36.42,59.44 38.71,57.15 JP25.1
LED_SCK  (via drill 0.3)
  Top 0.152: v7.92,57.45 4.12,57.45 JP20.1
  Bottom 0.152: v7.92,57.45 17.75,57.45 U4.11
LIN
  Bottom 0.152: JP28.1 3.73,41.99 12.95,41.99 13.18,42.22 13.18,43.74 12.95,43.97 12.8,43.97 7.01,49.76 7.01,57.91 C37.+
LOUT  (via drill 0.3)
  Top 0.152: v9.53,31.32 9.53,35.28 2.9,41.91 JP29.1
  Bottom 0.152: v9.53,31.32 C33.+
LOUT_JACK
  Bottom 0.152: R61.1 21.64,2.29 24.99,2.29 25.07,2.21 J11.IN
N$1
  Bottom 0.152: R21.2 27.28,27.74 25.15,27.74 J4.IN
N$2  (via drill 0.3)
  Top 0.152: v29.03,35.59 v29.03,31.17 | v15.93,87.02 v18.52,84.43
  Bottom 0.152: v29.03,31.17 27.36,29.49 R21.1 | v29.03,35.59 24.31,40.31 23.16,40.31 21.41,42.06 21.41,46.79 28.57,53.95 28.57,64.62 27.2,65.99 26.52,65.99 26.06,66.45 26.06,69.19 27.74,70.87 28.88,70.87 29.11,71.09 29.11,73.84 v18.52,84.43 | v15.93,87.02 15.93,90.53 C10.1 | C10.1 16,90.53 17.45,90.53 R25.2 17.53,90.6 19.05,92.13 R22.1 | U2.6 16.84,99.06 13.87,96.09 13.87,92.58 15.85,90.6 C10.1
N$3
  Bottom 0.152: J1.C 7.62,32 12.88,32 J3.A
N$4
  Bottom 0.152: R24.2 28.88,15.32 25.53,15.32 25.15,14.94 J10.IN
N$5  (via drill 0.3)
  Top 0.152: v28.96,18.21 34.59,23.85 35.51,23.85 37.95,26.29 v37.95,37.57 | v35.13,57.23 35.13,62.1 34.21,63.02 v34.21,71.7
  Bottom 0.152: R23.1 28.27,92.35 28.42,92.35 31.47,95.4 31.47,98.15 30.56,99.06 U3.6 28.8,99.06 27.96,98.22 R26.2 27.89,98.15 26.44,98.15 C11.1 26.36,98.15 26.44,98.07 26.44,90.14 34.37,82.22 34.37,73.84 34.21,73.69 v34.21,71.7 | v28.96,18.21 28.96,17.07 R24.1 | v37.95,37.57 37.95,38.02 34.52,41.45 34.52,56.62 v35.13,57.23
N$6
  Bottom 0.152: R39.2 38.1,15.01 35.13,15.01 35.05,14.94 J6.IN
N$7
  Bottom 0.152: J3.C 17.53,32 22.78,32 J4.A
N$8
  Bottom 0.152: J4.C 27.36,32 32.69,32 J5.A
N$9
  Bottom 0.152: R9.1 27.51,63.86 27.2,63.86 25.76,65.3 25.45,65.3 LED4.1
N$10
  Bottom 0.152: R38.2 38.1,27.74 35.05,27.74 J5.IN
N$11  (via drill 0.3)
  Top 0.152: v35.2,56.24 33.38,58.06 33.38,65.84 v26.82,72.39 | v26.82,88.16 v26.82,75.21
  Bottom 0.152: 22.86,90.6 21.34,92.13 21.34,92.28 R36.1 21.26,92.35 20.19,93.42 20.19,99.29 21.18,100.28 22.71,100.28 U2.2 | 22.86,90.6 24.38,90.6 C20.1 24.46,90.53 v26.82,88.16 | 22.86,90.6 R34.2 | R38.1 38.1,30.48 39.32,31.7 39.32,37.11 35.2,41.22 v35.2,56.24 | v26.82,75.21 v26.82,72.39
N$12
  Bottom 0.152: R10.1 28.27,68.28 LED4.3
N$13
  Bottom 0.152: R60.2 1.29,22.33 1.29,20.88 2.97,19.2 J2.A
N$14
  Bottom 0.152: R32.2 11.43,15.32 14.78,15.32 15.16,14.94 J9.IN
N$15  (via drill 0.3)
  Top 0.152: v36.96,16.23 36.96,18.36 38.63,20.04 v38.63,35.97 | v33.83,54.79 34.67,54.79 36.8,56.92 v36.8,66.67 | v37.49,101.04 37.49,97.92 35.66,96.09 35.66,93.8 v36.96,92.51
  Bottom 0.152: C21.1 39.01,99.97 37.49,99.97 R35.2 37.49,100.05 v37.49,101.04 37.49,101.19 36.5,102.18 34.14,102.18 33.91,101.96 33.91,101.27 34.82,100.36 35.28,100.36 U3.2 | v36.96,16.23 37.41,16.69 38.1,16.69 R39.1 | v38.63,35.97 33.98,40.62 33.98,54.63 v33.83,54.79 | v36.8,66.67 36.8,73.84 36.88,73.91 36.88,79.1 35.66,80.31 35.66,86.72 38.94,89.99 38.94,91.44 38.1,92.28 R37.1 38.1,92.35 37.95,92.51 v36.96,92.51
N$16
  Bottom 0.152: R8.1 23.85,69.95 23.85,68.28 LED3.3
N$17
  Bottom 0.152: J2.C 7.62,19.2 12.88,19.2 J9.A
N$18  (via drill 0.3)
  Top 0.152: v10.9,55.09 10.9,57.53 v7.92,60.5
  Bottom 0.152: R55.1 15.24,47.85 13.72,47.85 R56.2 13.64,47.85 12.12,47.85 C44.1 12.12,47.93 12.12,53.87 v10.9,55.09 | v7.92,60.5 7.01,61.42 C37.-
N$19
  Bottom 0.152: J9.C 17.53,19.2 22.78,19.2 J10.A
N$20
  Bottom 0.152: R58.2 18.36,2.29 15.32,2.29 15.24,2.21 J8.IN
N$21
  Top 0.152: J8.NORM 15.16,9.75 12.88,9.75 5.33,2.21 J7.IN
  Bottom 0.152: R57.2 8.84,2.29 5.41,2.29 5.33,2.21 J7.IN
N$22
  Bottom 0.152: 26.67,47.85 25.15,47.85 R53.1 | 26.67,47.85 28.19,47.85 C43.1 28.19,47.93 28.19,53.11 31.09,56.01 31.09,59.51 32.99,61.42 C36.- | 26.67,47.85 R54.2
N$23
  Bottom 0.152: R52.2 30.48,11.58 32.08,13.18 R50.2 32.08,13.26 32.08,13.72 35.28,16.92 36.88,16.92 38.25,18.29 38.25,20.04 36.96,21.34 32.77,21.34 C41.-
N$24  (via drill 0.3)
  Top 0.152: v10.21,17.07 8.99,18.29 8.99,21.49 10.21,22.71 10.21,38.56 v9.75,39.01 | v8.38,40.39 8.38,46.56 11.58,49.76 11.58,64.69 v10.59,65.68 | v11.89,83.21 13.34,84.66 v13.34,86.94 9.6,86.94 8.46,88.09 8.46,89 6.63,90.83 v6.63,98.45
  Bottom 0.152: 13.41,98.22 13.95,98.22 R31.2 | 13.41,98.22 12.42,98.22 C22.1 | v10.21,17.07 11.43,17.07 R32.1 | v8.38,40.39 v9.75,39.01 | v10.59,65.68 10.59,71.7 8.38,73.91 8.38,76.73 7.16,77.95 R33.1 7.16,78.03 7.16,79.32 11.05,83.21 v11.89,83.21 | 13.41,98.22 13.41,87.02 v13.34,86.94 | U1.6 6.02,99.06 v6.63,98.45
N$25
  Bottom 0.152: R52.1 30.48,13.26 28.96,13.26 C42.1 28.88,13.26 27.36,13.26 R48.2 27.28,13.26 25.83,13.26 25.45,13.64 22.78,13.64 U6.6
N$26
  Bottom 0.152: R33.2 7.16,76.28 7.16,74.37 R43.2
N$27
  Bottom 0.152: R29.2 12.72,27.74 15.16,27.74 J3.IN
N$28
  Bottom 0.152: R62.2 31.47,4.04 36.73,4.04 38.25,5.56 38.25,8.23 35.51,10.97 32.92,10.97 32.69,10.74 29.72,10.74 28.96,11.51 C42.2 28.88,11.58 27.36,11.58 R48.1 27.28,11.51 26.9,11.12 24.54,11.12 23.32,12.34 22.78,12.34 U6.7
N$29
  Bottom 0.152: R7.1 27.58,62.26 27.58,62.48 28.27,63.17 28.27,64.47 27.05,65.68 26.29,65.68 25.76,66.22 22.94,66.22 22.1,65.38 21.03,65.38 LED3.1
N$30  (via drill 0.3)
  Top 0.152: v18.82,31.32 18.82,33.3 26.75,41.22 30.02,41.22 30.48,41.68 30.48,44.2 27.66,47.02 27.66,67.67 21.34,73.99 21.34,89.15 18.75,91.75 13.87,91.75 | v9.14,91.75 13.87,91.75 | v15.01,99.06 15.01,97.23 13.87,96.09 13.87,91.75
  Bottom 0.152: C9.1 1.45,98.22 2.97,98.22 R27.2 3.05,98.15 3.05,97.61 7.24,93.42 7.24,92.35 R28.1 7.32,92.28 7.85,91.75 v9.14,91.75 | v18.82,31.32 16.99,29.49 12.72,29.49 R29.1 | v15.01,99.06 15.01,100.28 14.63,100.66 11.73,100.66 11.43,100.36 10.29,100.36 U1.2
N$31  (via drill 0.3)
  Top 0.152: v8.53,21.95 v8.53,17.22
  Bottom 0.152: R51.2 9.83,11.58 8.31,11.58 R59.2 8.23,11.58 8.23,11.81 7.47,12.57 7.47,16.15 v8.53,17.22 | v8.53,21.95 9.53,22.94 C33.-
N$32
  Bottom 0.152: 11.43,13.26 9.91,13.26 R51.1 | 11.43,13.26 12.95,13.26 R49.2 13.03,13.26 14.48,13.26 14.71,13.49 16,13.49 17.07,12.42 17.53,12.42 U6.2 | 11.43,13.26 C40.1
N$33  (via drill 0.3)
  Top 0.152: v17.6,9.3 v21.57,5.33
  Bottom 0.152: C40.2 11.43,11.58 12.95,11.58 R49.1 13.03,11.51 14.33,11.51 14.71,11.12 17.53,11.12 U6.1 17.6,11.05 v17.6,9.3 | v21.57,5.33 21.57,4.04 R61.2
N$34
  Bottom 0.152: R6.1 19.36,69.95 19.36,68.28 LED2.3
N$35
  Bottom 0.152: R28.2 7.24,90.53 7.24,88.7 7.16,88.62 R18.2
N$36  (via drill 0.3)
  Top 0.152: v13.79,38.56 13.79,33.6 10.52,30.33 10.52,19.36 v9.68,18.52
  Bottom 0.152: R15.1 15.24,40.01 v13.79,38.56 | v9.68,18.52 8.91,18.52 5.33,14.94 J2.IN
N$37
  Bottom 0.152: R15.2 15.24,42.75 13.34,40.84 Q2.1
N$38
  Bottom 0.152: R2.2 29.87,51.59 31.39,51.59 R1.2 31.47,51.51 32.84,51.51 33.07,51.28 L1.A
N$39  (via drill 0.3)
  Top 0.152: v24.23,63.02 18.82,63.02 16.54,65.3 LED2.1
  Bottom 0.152: v24.23,63.02 26.44,63.02 26.59,62.87 26.59,61.72 27.51,60.81 27.51,60.66 R5.1
N$40
  Bottom 0.152: R3.1 14.86,69.95 14.86,68.28 LED1.3
N$41
  Bottom 0.152: R4.1 27.51,59.05 27.51,58.14 23.7,54.33 21.49,54.33 19.36,56.46 19.36,61.42 18.82,61.95 15.39,61.95 12.04,65.3 LED1.1
N$42
  Top 0.152: POT1.R2_2 20.19,45.03 22.63,45.03 POT1.R2_3
  Bottom 0.152: R53.2 25.07,46.1 23.7,46.1 22.71,45.11 POT1.R2_3 22.71,45.03 23.85,43.89 23.85,42.6 24.46,41.99 25.6,41.99 25.91,41.68 25.91,40.31 32.16,34.06 37.49,34.06 38.25,33.3 38.25,31.09 37.26,30.1 30.63,30.1 30.18,29.64 30.18,29.18 27.43,26.44 24.77,26.44 23.47,25.15 22.78,25.15 U5.7
N$43
  Bottom 0.152: R10.2 28.19,71.7 25.15,71.7 24.16,72.69 14.55,72.69 14.02,72.16 14.02,67.36 15.7,65.68 15.7,64.16 17.3,62.56 17.75,62.56 U4.15
N$44
  Bottom 0.152: R9.2 25.76,63.86 22.63,63.86 U4.1
N$45
  Bottom 0.152: R8.2 23.77,71.63 23.77,71.32 20.5,68.05 20.5,66.06 20.12,65.68 20.12,64.54 22.1,62.56 22.55,62.56 U4.2
N$46
  Bottom 0.152: R7.2 25.76,62.18 23.93,62.18 23.09,61.34 22.63,61.34 U4.3
N$47
  Bottom 0.152: R6.2 19.36,71.63 19.36,71.32 17.07,69.04 17.07,66.22 20.34,62.94 20.34,61.34 21.64,60.05 22.55,60.05 U4.4
N$48
  Bottom 0.152: R5.2 25.76,60.58 25.3,60.58 23.47,58.75 22.63,58.75 U4.5
N$49  (via drill 0.3)
  Top 0.152: v19.66,66.14 20.57,66.14 20.65,66.22 21.79,66.22 24.31,63.7 24.46,63.7 24.92,63.25 24.92,59.28 v24.23,58.6
  Bottom 0.152: v19.66,66.14 20.19,66.67 20.19,72.24 20.04,72.39 18.67,72.39 17.98,71.7 14.94,71.7 R3.2 | v24.23,58.6 23.16,57.53 22.63,57.53 U4.6
N$50
  Bottom 0.152: R4.2 25.76,59.05 23.85,57.15 23.85,57.07 23.01,56.24 22.63,56.24 U4.7
N$51  (via drill 0.3)
  Top 0.152: v16.38,46.79 17.6,46.79 18.97,45.41 18.97,43.74 20.12,42.6 POT1.R1_2 20.19,42.52 22.63,42.52 POT1.R1_3 | v17.6,22.94 17.6,30.86 18.14,31.39 18.14,37.26 v19.89,39.01
  Bottom 0.152: v16.38,46.79 15.77,46.18 15.24,46.18 R55.2 | v17.6,22.94 17.6,23.77 U5.1 | v19.89,39.01 19.89,42.29 20.12,42.52 POT1.R1_2
N$52  (via drill 0.3)
  Top 0.152: v28.35,26.44 28.35,32.99 v28.04,33.3
  Bottom 0.152: v28.35,26.44 27.58,25.68 27.36,25.68 R47.1 | v28.04,33.3 26.36,33.3 25.6,34.06 23.93,34.06 18.82,39.17 18.82,43.89 17.68,45.03 POT1.R2_1
N$53  (via drill 0.3)
  Top 0.152: v13.87,26.82 13.87,28.04 15.7,29.87 16.15,29.87 17.37,31.09 v17.37,39.01
  Bottom 0.152: v13.87,26.82 12.72,25.68 R46.1 | v17.37,39.01 17.37,42.29 17.6,42.52 POT1.R1_1
N$54
  Bottom 0.152: R58.1 18.44,3.96 20.27,3.96 20.95,3.28 24.54,3.28 24.61,3.35 30.71,3.35 30.79,3.28 34.44,3.28 34.9,3.73 36.88,3.73 38.94,5.79 38.94,20.27 35.36,23.85 32.16,23.85 31.32,24.69 28.12,24.69 27.36,23.93 R47.2 27.28,23.85 24.61,23.85 24.08,24.38 21.72,24.38 21.41,24.69 21.41,25.45 22.25,26.29 22.71,26.29 U5.6
N$55
  Bottom 0.152: J10.C 27.36,19.2 32.69,19.2 J6.A
N$56
  Bottom 0.152: R63.2 1.29,9.3 1.29,8.15 2.97,6.48 J7.A
N$57  (via drill 0.3)
  Top 0.152: v19.36,36.5 v23.85,41 | v8.84,32.99 8.84,31.24 5.33,27.74 J1.IN
  Bottom 0.152: v23.85,41 25.07,41 R12.1 | v19.36,36.5 12.34,36.5 v8.84,32.99
N$58  (via drill 0.3)
  Top 0.152: v10.67,5.79 11.58,5.79 14.33,8.53 15.7,8.53 16.38,9.22 16.38,15.39 14.71,17.07 14.33,17.07 13.03,18.36 v13.03,22.78
  Bottom 0.152: v10.67,5.79 8.91,4.04 R57.1 | v13.03,22.78 13.03,23.55 12.72,23.85 R46.2 12.95,23.7 15.54,23.7 16.92,25.07 17.53,25.07 U5.2
N$59
  Bottom 0.152: J7.C 7.62,6.48 12.88,6.48 J8.A
N$60
  Bottom 0.152: J8.C 17.53,6.48 22.78,6.48 J11.A
N$61
  Bottom 0.152: J11.C 27.36,6.48 32.69,6.48 J12.A
N$62
  Bottom 0.152: R42.2 1.29,34.98 1.29,33.68 2.97,32 J1.A
N$66
  Bottom 0.152: R12.2 25.15,42.75 26.67,42.75 28.57,40.84 28.88,40.84 Q1.1
N$75  (via drill 0.3)
  Top 0.305: 1.22,25.15 1.22,39.32 JP68.1 | 1.22,25.15 v1.22,20.04 | v1.29,25.15 1.22,25.15
  Bottom 0.305: v1.22,20.04 1.22,11.05 R63.1 | v1.29,25.15 1.29,24.08 R60.1 | R42.1 1.29,36.73 1.29,39.32 JP68.1
PITCH_POT
  Top 0.152: R20.2 33.15,88.54 33.15,82.83 38.48,77.5 38.71,77.5 JP15.1
PLAY
  Bottom 0.152: 9.53,42.82 12.19,42.82 12.34,42.98 Q2.3 | 9.53,42.82 9.53,42.98 1.29,51.21 1.29,52.05 JP23.1 | 9.53,42.82 R16.1
POSITION_POT_CV  (via drill 0.3)
  Top 0.152: v0.99,101.04 0.84,100.89 0.84,80.31 1.22,79.93 1.22,77.5 JP5.1
  Bottom 0.152: U1.1 10.21,101.58 9.68,101.04 3.96,101.04 2.97,100.05 R27.1 2.97,99.97 1.45,99.97 C9.2 1.45,100.05 0.99,100.51 v0.99,101.04
REC  (via drill 0.3)
  Top 0.152: v30.79,44.81 30.79,50.22 37.57,57 37.57,58.52 JP22.1
  Bottom 0.152: Q1.3 27.96,42.98 28.12,42.82 30.79,42.82 R14.1 30.79,42.9 v30.79,44.81
RIN
  Bottom 0.152: C36.+ 35.43,57.91 JP27.1
ROUT  (via drill 0.3)
  Top 0.152: v30.86,29.41 30.86,37.41 v37.19,43.74
  Bottom 0.152: v30.86,29.41 30.86,26.9 C41.+ | v37.19,43.74 37.19,50.52 JP30.1
ROUT_JACK
  Bottom 0.152: R62.1 31.47,2.29 34.9,2.29 34.98,2.21 J12.IN
SIZE_CV
  Bottom 0.152: C10.2 15.93,92.35 17.45,92.35 R25.1 17.45,92.43 17.45,93.04 | 17.45,93.04 17.45,94.41 19.89,96.85 19.89,98.6 18.21,100.28 17.6,100.28 U2.7 | 17.45,93.04 19.74,93.04 19.89,92.89 19.89,90.53 20.57,89.84 20.65,89.84 21.34,89.15 21.34,88.09 19.2,85.95 12.19,85.95 3.43,77.19 3.43,67.74 1.29,65.61 1.29,64.77 JP9.1
SIZE_POT
  Top 0.152: JP13.1 1.29,69.8 3.43,69.8 4.42,68.81 13.79,68.81 18.97,73.99 18.97,83.97 20.12,85.11 20.12,88.54 R19.2
SW_LOAD
  Top 0.152: 35.43,69.88 35.43,70.03 SW3.4 35.43,69.88 | 35.43,69.88 35.43,63.55 SW3.3 | 35.43,69.88 38.71,69.88 JP18.1
SW_MODE
  Bottom 0.152: JP17.1 1.29,62.26 5.87,62.26 7.09,63.48 9.37,63.48 SW2.3 9.45,63.55 9.45,70.03 SW2.4
SW_REC
  Top 0.152: JP24.1 1.29,49.53 1.52,49.3 4.88,49.3 SW1.1 4.88,49.38 4.88,55.78 SW1.2
TEXTURE_CV
  Bottom 0.152: C11.2 26.36,99.97 27.89,99.97 R26.1 27.96,99.97 29.79,99.97 30.1,100.28 U3.7 30.18,100.28 30.63,100.28 35.66,95.25 35.66,94.56 37.03,93.19 38.63,93.19 39.4,92.43 39.4,79.86 37.57,78.03 37.57,65.91 38.71,64.77 JP8.1
TEXTURE_POT
  Top 0.152: JP14.1 1.29,67.36 12.88,67.36 19.81,74.3 20.12,74.3 R44.2
V_OCT
  Bottom 0.152: 22.86,92.35 24.38,92.35 C20.2 24.46,92.28 25.3,91.44 25.3,90.83 32.08,84.05 32.08,80.85 31.93,80.7 31.93,73.84 32.08,73.69 32.08,69.72 38.71,63.09 38.71,62.26 JP6.1 | 22.86,92.35 22.86,94.34 22.71,94.49 22.71,96.09 23.85,97.23 23.93,97.23 24.08,97.38 24.08,100.74 23.24,101.58 22.78,101.58 U2.1 | 22.86,92.35 R34.1
VCC  (via drill 0.3)
  Top 0.305: v21.11,12.19 v21.11,20.73 21.18,20.8 21.18,25.6 24.54,28.96 25.22,28.96 27.28,31.01 27.28,34.9 38.71,46.33 38.71,46.94 JP31.1
  Bottom 0.305: C39.1 21.03,9.22 21.03,9.37 22.71,11.05 U6.8 22.4,10.9 v21.11,12.19 | U5.8 22.71,23.77 21.03,22.1 21.03,21.95 C38.1 21.11,21.79 v21.11,20.73
VEE  (via drill 0.3)
  Top 0.305: v19.2,18.52 v19.2,26.98 19.58,27.36 19.58,31.62 24.54,36.58 25.98,36.58 38.71,49.3 38.71,49.53 JP32.1
  Bottom 0.305: U6.4 17.6,14.94 19.28,16.61 19.28,16.76 C46.2 19.2,16.92 v19.2,18.52 | 18.06,28.12 17.6,27.66 U5.4 | 18.06,28.12 19.28,29.34 19.28,29.49 C45.2 | 18.06,28.12 v19.2,26.98

### Text on the board
bPlace: ANTUMBRA | SMOG V1.1
tNames: PCB 1/2 | SMOG V1.1 / DESIGN BY OLIVIER GILLET / REDESIGN BY DAVID SZEBENYI | cc-by-sa Olivier Gillet, 2015. v3